# EAGLE schematic OpenTracker_GPS (EAGLE 6.2)
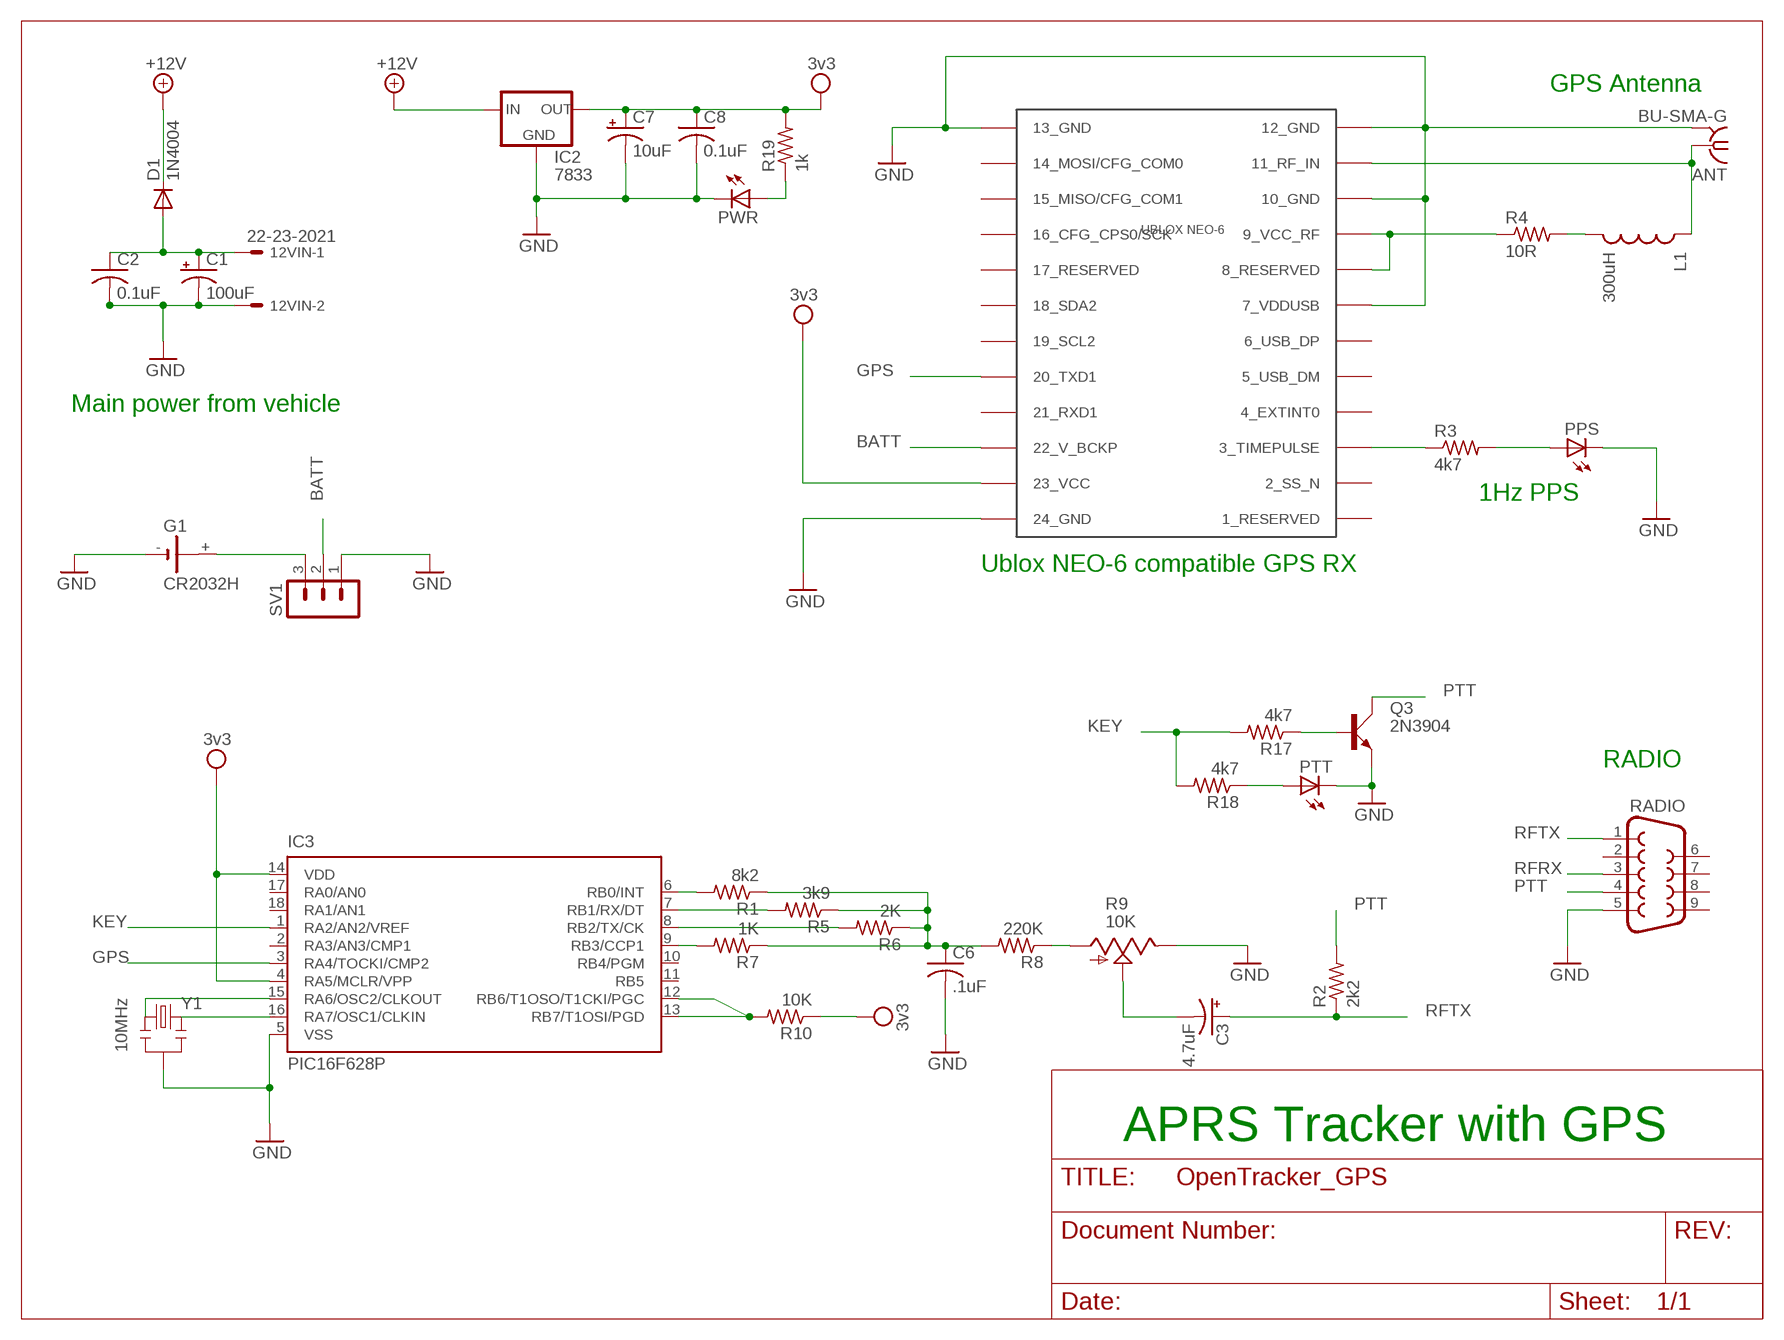
[diagram p0: schematic, sheet 1]

## Parts
12VIN  22-23-2021  [22-23-2021]
ANT  BU-SMA-G  [BU-SMA-G]
C1  100uF  CAP_POLPTH2  [CPOL-RADIAL-10UF-25V]
C2  0.1uF  C-US025-025X050  [C025-025X050]
C3  4.7uF  CAP_POLPTH2  [CPOL-RADIAL-10UF-25V]
C6  .1uF  C-US025-025X050  [C025-025X050]
C7  10uF  CAP_POLPTH2  [CPOL-RADIAL-10UF-25V]
C8  0.1uF  C-US025-025X050  [C025-025X050]
D1  1N4004  [DO41-10]
G1  CR2032H  [CR2032H]
IC2  7833  V_REG_78XX-TO-220  [TO-220-ALT]
IC3  PIC16F628P  [DIL18]
L1  300uH  INDUCTOR0805  [0805]
PPS  LED0603  [LED-0603]
PTT  LED3MM  [LED3MM]
PWR  LED3MM  [LED3MM]
Q3  2N3904  [TO92D]
R1  8k2  R-US_0207/2V  [0207/2V]
R2  2k2  R-US_0207/2V  [0207/2V]
R3  4k7  R-US_M0805  [M0805]
R4  10R  R-US_M0805  [M0805]
R5  3k9  R-US_0207/2V  [0207/2V]
R6  2K  R-US_0207/2V  [0207/2V]
R7  1K  R-US_0207/2V  [0207/2V]
R8  220K  R-US_0207/2V  [0207/2V]
R9  10K  TRIM_US-CA6V  [CA6V]
R10  10K  R-US_0207/2V  [0207/2V]
R17  4k7  R-US_0207/2V  [0207/2V]
R18  4k7  R-US_0207/2V  [0207/2V]
R19  1k  R-US_0207/2V  [0207/2V]
RADIO  F09HP  [F09HP]
SV1  MA03-1  [MA03-1]
U$1  UBLOX_NEO-6  [UBLOX_NEO-6P]
Y1  10MHz  RESONATORPTH  [RESONATOR-PTH]

## Nets
+12V: D1.C IC2.IN
BATT: SV1.2 U$1.22_V_BCKP
GND: 12VIN.2 ANT.2(GND) C1.2(-) C2.2 C6.2 C7.2(-) C8.2 G1.- IC2.GND IC3.5(VSS) PPS.C PTT.K(C) PWR.K(C) Q3.E R9.E RADIO.5 SV1.1 U$1.7_VDDUSB U$1.10_GND U$1.12_GND U$1.13_GND U$1.24_GND Y1.2
GPS: IC3.3(RA4/TOCKI/CMP2) U$1.20_TXD1
KEY: IC3.1(RA2/AN2/VREF) R17.2 R18.2
N$1: R3.1 U$1.3_TIMEPULSE
N$2: ANT.1 L1.1 U$1.11_RF_IN
N$3: L1.2 R4.2
N$4: R4.1 U$1.8_RESERVED U$1.9_VCC_RF
N$5: PPS.A R3.2
N$6: PWR.A R19.1
N$7: G1.+ SV1.3
N$8: IC3.6(RB0/INT) R1.2
N$9: IC3.16(RA7/OSC1/CLKIN) Y1.3
N$10: IC3.15(RA6/OSC2/CLKOUT) Y1.1
N$11: IC3.7(RB1/RX/DT) R5.2
N$12: IC3.8(RB2/TX/CK) R6.2
N$13: IC3.9(RB3/CCP1) R7.2
N$14: 12VIN.1 C1.1(+) C2.1 D1.A
N$15: C6.1 R1.1 R5.1 R6.1 R7.1 R8.2
N$16: IC3.12(RB6/T1OSO/T1CKI/PGC) IC3.13(RB7/T1OSI/PGD) R10.2
N$17: C3.2(-) R9.S
N$19: R8.1 R9.A
N$25: Q3.B R17.1
N$27: PTT.A R18.1
PTT: Q3.C R2.2 RADIO.4
RFRX: RADIO.3
RFTX: C3.1(+) R2.1 RADIO.1
VDD: C7.1(+) C8.1 IC2.OUT IC3.4(RA5/MCLR/VPP) IC3.14(VDD) R10.1 R19.2 U$1.23_VCC ; supply symbol labelled 3v3
Unconnected: G1.+@1(+) IC3.2(RA3/AN3/CMP1) IC3.10(RB4/PGM) IC3.11(RB5) IC3.17(RA0/AN0) IC3.18(RA1/AN1) RADIO.2 RADIO.6 RADIO.7 RADIO.8 RADIO.9 U$1.1_RESERVED U$1.2_SS_N U$1.4_EXTINT0 U$1.5_USB_DM U$1.6_USB_DP U$1.14_MOSI/CFG_COM0 U$1.15_MISO/CFG_COM1 U$1.16_CFG_CPS0/SCK U$1.17_RESERVED U$1.18_SDA2 U$1.19_SCL2 U$1.21_RXD1

## Notes on the sheet
- GPS Antenna
- Main power from vehicle
- 1Hz PPS
- Ublox NEO-6 compatible GPS RX
- RADIO
- APRS Tracker with GPS

## Power pins joined to a net without a drawn wire
GND: ANT.3(GND) ANT.4(GND) ANT.5(GND)

## Library data of the parts
12VIN = con-molex:22-23-2021: .100" (2.54mm) Center Header - 2 Pin; MF: MOLEX; MPN: 22-23-2021; OC_FARNELL: 1462926; OC_NEWARK: 25C3832
ANT = con-coax:BU-SMA-G: FEMALE SMA CONNECTOR Radiall distributor RS 193-9117; OC_FARNELL: unknown; OC_NEWARK: unknown
C1 C3 C7 = SparkFun :CAP_POL: Capacitor Polarized These are standard SMD and PTH capacitors. Normally 10uF, 47uF, and 100uF in electrolytic and tantalum varieties. Always verify the external diameter of the through hole cap, it varies with capacity, voltage, and manufacturer. The EIA devices should be standard.
C2 C6 C8 = rcl:C-US: CAPACITOR, American symbol
D1 = diode:1N4004: DIODE general purpose rectifier, 1 A
G1 = battery:CR2032H: LI BATTERY Varta
IC2 = SparkFun :V_REG_78XX: Voltage Regulator Standard 7805 5V regulator. IGO (Input Ground Output). Spark Fun Electronics SKU : COM-00107
IC3 = microchip-6:PIC16F62*: FLASH-Based 8-Bit CMOS Microcontroller Source: http://ww1.microchip.com/downloads/en/DeviceDoc/40300C.pdf
L1 = SparkFun :INDUCTOR: Inductors Basic Inductor/Choke - 0603 and 1206. Footprints are not proven and vary greatly between part numbers.
PPS PTT PWR = SparkFun :LED: LEDs Standard schematic elements and footprints for 5mm, 3mm, 1206, and 0603 sized LEDs. 5mm - Spark Fun Electronics SKU : COM-00529 (and others)
Q3 = transistor-small-signal:2N3904: NPN TRANSISTOR
R1-R8 R10 R17-R19 = resistor:R-US_: RESISTOR, American symbol
R9 = pot:TRIM_US-: POTENTIOMETER
RADIO = con-subd:F09: SUB-D; OC_FARNELL: unknown; OC_NEWARK: unknown
SV1 = con-lstb:MA03-1: PIN HEADER; OC_FARNELL: unknown; OC_NEWARK: unknown
U$1 = Ava:UBLOX_NEO-6: UBLOX NEO-6 GPS MODULE Author Anthony Stirk / http://ava.upuaut.net http://www.u-blox.com/images/downloads/Product_Docs/LEA-6_NEO-6_MAX-6_HardwareIntegrationManual_%28GPS.G6-HW-09007%29.pdf http://www.u-blox.com/images/downloads/Product_Docs/NEO-6_DataSheet_%28GPS.G6-HW-09005%29.pdf
Y1 = SparkFun:RESONATOR: Resonator Small SMD resonator. This is the itty bitty 10/20MHz resonators with built in caps. CSTCE10M0G55 and CSTCE20M0V53. Footprint has been reviewed closely but hasn't been tested yet.